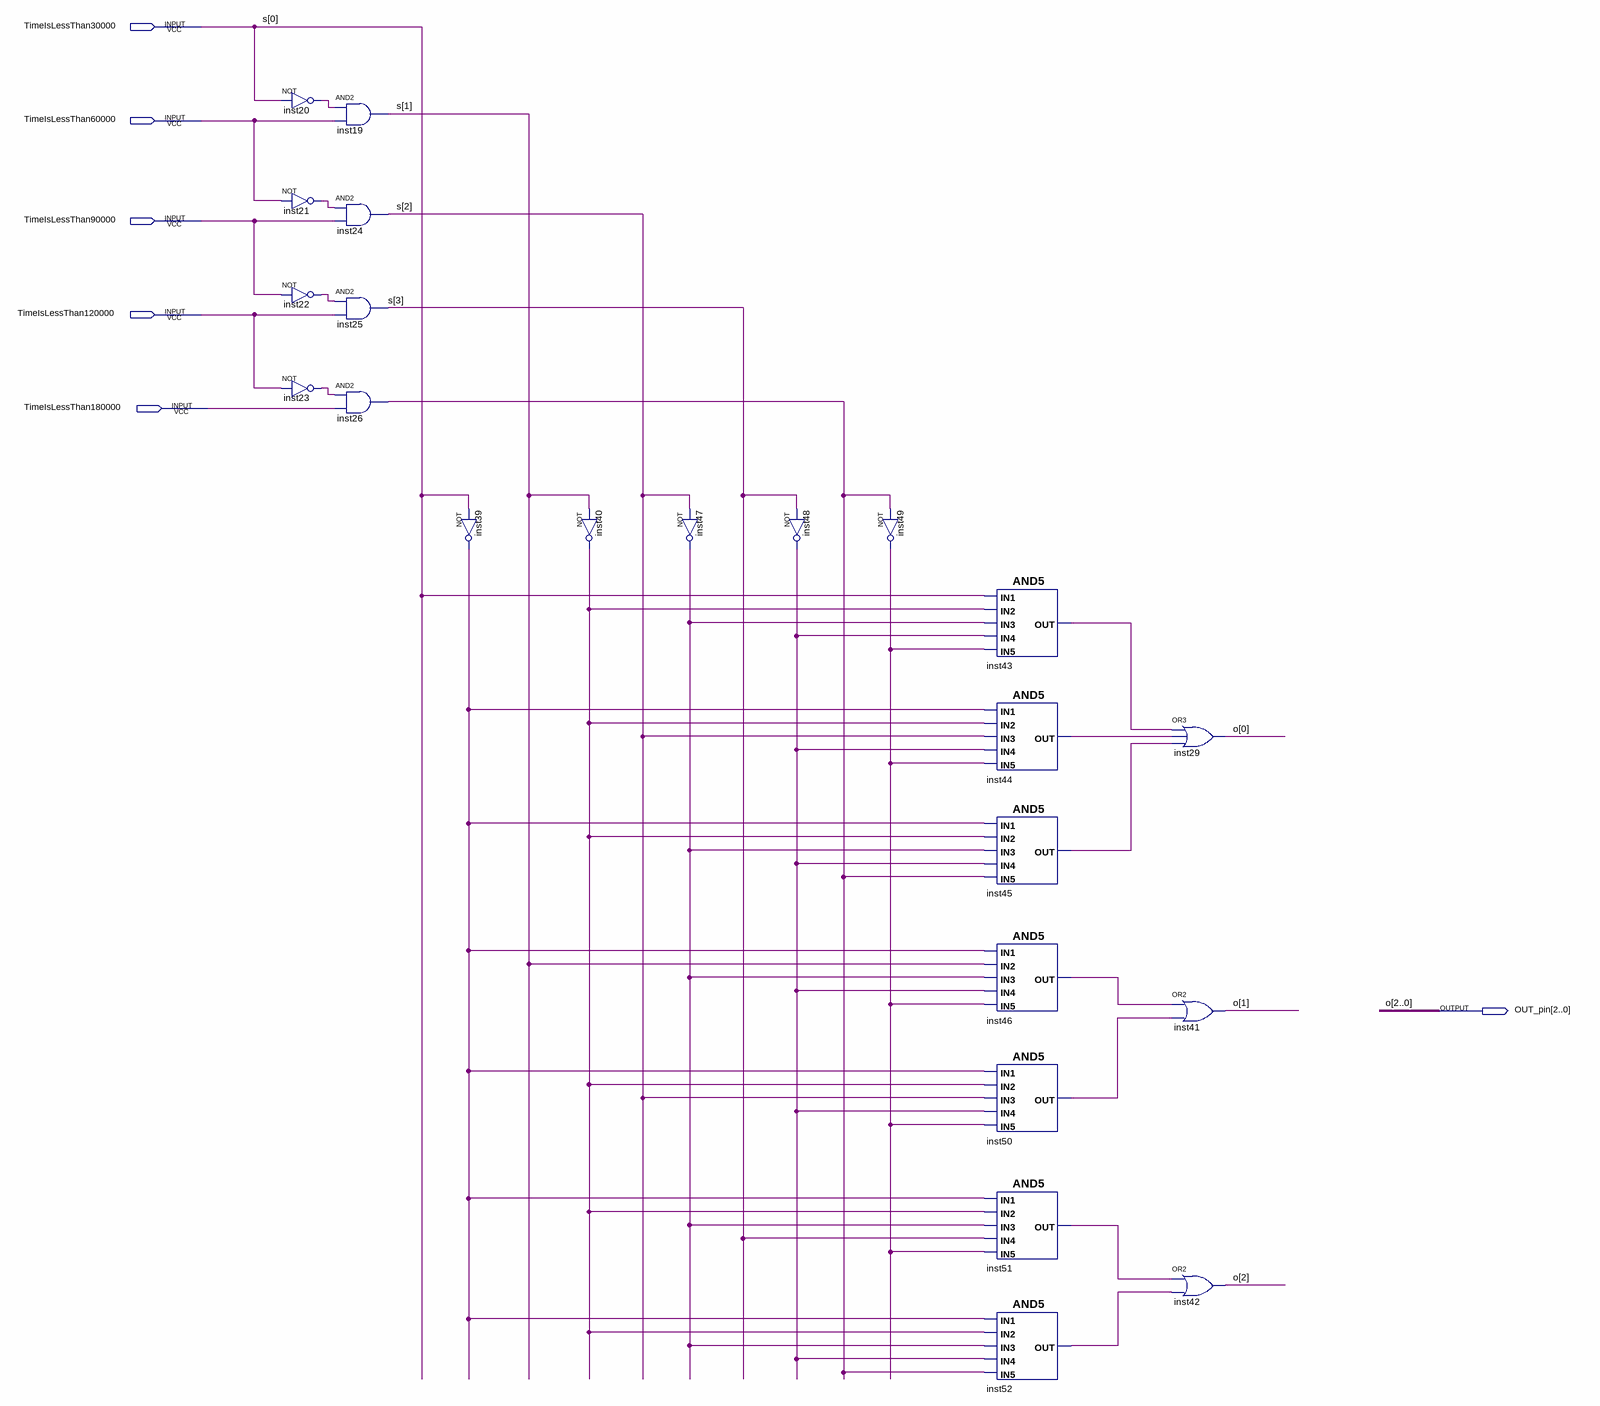
[diagram p0: schematic sheet]
// Quartus schematic 5to3bits.bdf as structural Verilog: 23 symbols, 6 pins
module \5to3bits  (
  input  TimeIsLessThan30000,
  input  TimeIsLessThan60000,
  input  TimeIsLessThan90000,
  input  TimeIsLessThan120000,
  input  TimeIsLessThan180000,
  output [2:0] OUT_pin
);

  wire inst20_out, inst21_out, inst22_out, inst23_out, inst26_out, inst39_out, inst40_out, inst43_out,
       inst44_out, inst45_out, inst46_out, inst47_out, inst48_out, inst49_out, inst50_out, inst51_out,
       inst52_out;
  wire [3:1] s;

  not inst20 (inst20_out, TimeIsLessThan30000);
  not inst21 (inst21_out, TimeIsLessThan60000);
  not inst22 (inst22_out, TimeIsLessThan90000);
  not inst23 (inst23_out, TimeIsLessThan120000);
  and inst19 (s[1], inst20_out, TimeIsLessThan60000);
  and inst24 (s[2], inst21_out, TimeIsLessThan90000);
  and inst25 (s[3], inst22_out, TimeIsLessThan120000);
  and inst26 (inst26_out, inst23_out, TimeIsLessThan180000);
  not inst39 (inst39_out, TimeIsLessThan30000);
  not inst40 (inst40_out, s[1]);
  not inst47 (inst47_out, s[2]);
  not inst48 (inst48_out, s[3]);
  not inst49 (inst49_out, inst26_out);
  and inst43 (inst43_out, TimeIsLessThan30000, inst40_out, inst47_out, inst48_out, inst49_out);
  and inst44 (inst44_out, inst39_out, inst40_out, s[2], inst48_out, inst49_out);
  and inst45 (inst45_out, inst39_out, inst40_out, inst47_out, inst48_out, inst26_out);
  and inst46 (inst46_out, inst39_out, s[1], inst47_out, inst48_out, inst49_out);
  and inst50 (inst50_out, inst39_out, inst40_out, s[2], inst48_out, inst49_out);
  and inst51 (inst51_out, inst39_out, inst40_out, inst47_out, s[3], inst49_out);
  and inst52 (inst52_out, inst39_out, inst40_out, inst47_out, inst48_out, inst26_out);
  or inst29 (OUT_pin[0], inst43_out, inst44_out, inst45_out);
  or inst41 (OUT_pin[1], inst46_out, inst50_out);
  or inst42 (OUT_pin[2], inst51_out, inst52_out);

  // Other names for the same wires on the sheet: o[2:0] = OUT_pin; s[0] = TimeIsLessThan30000
endmodule
